# EAGLE design RJ45 Adapter (EAGLE 8.4.0)
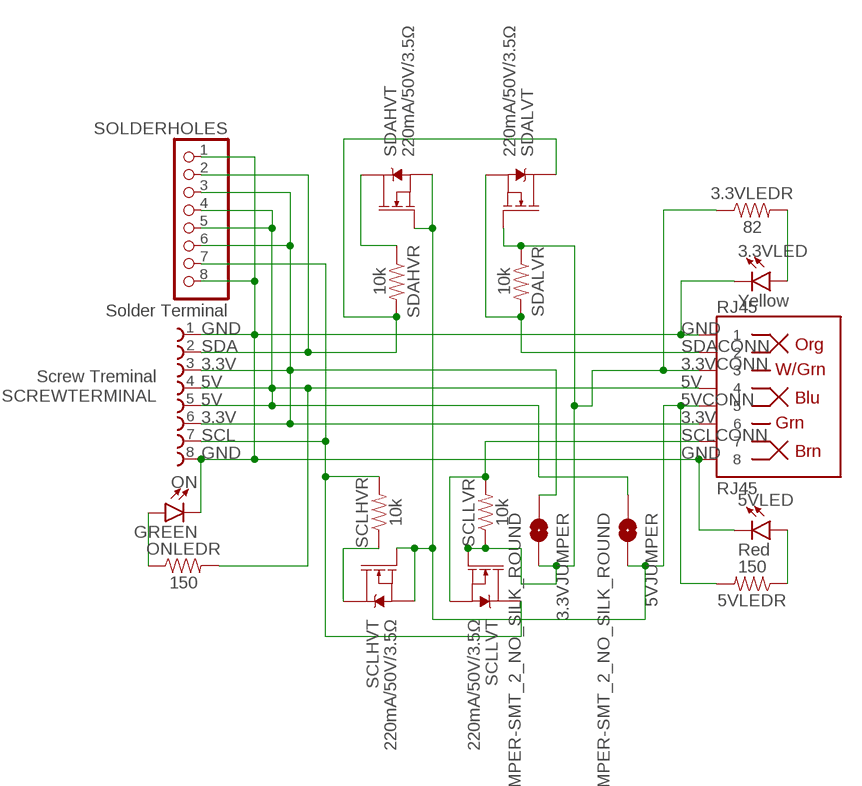
[diagram p0: schematic, sheet 1]

## Parts
3.3VJUMPER  JUMPER-SMT_2_NO_SILK_ROUND  [SMT-JUMPER_2_NO_SILK_ROUND]
3.3VLED  Yellow  LED-YELLOW0603-SMART  [LED-0603]
3.3VLEDR  82  82OHM-0603-1/10W-1%  [0603]
5VJUMPER  JUMPER-SMT_2_NO_SILK_ROUND  [SMT-JUMPER_2_NO_SILK_ROUND]
5VLED  Red  LED-RED0603-SMART  [LED-0603]
5VLEDR  150  150OHM-0603-1/10W-1%  [0603]
ON  GREEN  LED-GREEN0603  [LED-0603]
ONLEDR  150  150OHM-0603-1/10W-1%  [0603]
RJ45  RJ45  RJ45-8  [RJ45-8]
SCLHVR  10k  10KOHM-0603-1/10W-1%  [0603]
SCLHVT  220mA/50V/3.5Ω  MOSFET-NCH-BSS138  [SOT23-3]
SCLLVR  10k  10KOHM-0603-1/10W-1%  [0603]
SCLLVT  220mA/50V/3.5Ω  MOSFET-NCH-BSS138  [SOT23-3]
SCREWTERMINAL  Screw Treminal  691243300008  [691243300008]
SDAHVR  10k  10KOHM-0603-1/10W-1%  [0603]
SDAHVT  220mA/50V/3.5Ω  MOSFET-NCH-BSS138  [SOT23-3]
SDALVR  10k  10KOHM-0603-1/10W-1%  [0603]
SDALVT  220mA/50V/3.5Ω  MOSFET-NCH-BSS138  [SOT23-3]
SOLDERHOLES  Solder Terminal  PINHD-1X8-3.5MM  [1X08-3.5MM]

## Nets
3.3LEDR: 3.3VLED.A 3.3VLEDR.2
3.3V: 3.3VJUMPER.1 RJ45.6 SCREWTERMINAL.3 SCREWTERMINAL.6 SOLDERHOLES.3 SOLDERHOLES.6
3.3VCONN: 3.3VJUMPER.2 3.3VLEDR.1 RJ45.3 SCLLVR.1 SCLLVT.1(G) SDALVR.1 SDALVT.1(G)
5V: 5VJUMPER.1 ONLEDR.2 RJ45.4 SCREWTERMINAL.4 SCREWTERMINAL.5 SOLDERHOLES.4 SOLDERHOLES.5
5VCONN: 5VJUMPER.2 5VLEDR.2 RJ45.5 SCLHVT.1(G) SCLHVT.2(S) SDAHVT.1(G) SDAHVT.2(S)
5VLEDR: 5VLED.A 5VLEDR.1
GND: 3.3VLED.C 5VLED.C ON.C RJ45.1 RJ45.8 SCREWTERMINAL.1 SCREWTERMINAL.8 SOLDERHOLES.1 SOLDERHOLES.8
ONLEDR: ON.A ONLEDR.1
SCL: SCLHVR.2 SCLLVT.3(D) SCREWTERMINAL.7 SOLDERHOLES.7
SCLCONN: RJ45.7 SCLLVR.2 SCLLVT.2(S)
SCLHV: SCLHVR.1 SCLHVT.3(D)
SDA: SCREWTERMINAL.2 SDAHVR.2 SDALVT.3(D) SOLDERHOLES.2
SDACONN: RJ45.2 SDALVR.2 SDALVT.2(S)
SDAHV: SDAHVR.1 SDAHVT.3(D)

## Library data of the parts
3.3VJUMPER 5VJUMPER = SparkFun-Jumpers:JUMPER-SMT_2_NO: Normally open jumper This jumper has two pads in close proximity to each other. Apply solder to close the connection. Round pads are easier to solder for beginners, but are a lot larger. SparkFun Product that uses the round pads: SparkFun EL Sequencer <https://www.sparkfun.com/products/12781>
3.3VLED = SparkFun-LED:LED-YELLOW: Yellow SMD LED Used in manufacturing several products at SparkFun. Packages: 0603 - SMD 0603 package[Product Link] <http://www.kingbrightusa.com/product.asp?catalog_name=LED&product_id=APT1608SYCK> 0603 -SMART - SMART SMD 0603 package (more efficient/more expensive) [Product Link] <http://www.osram-os.com/osram_os/en/products/product-catalog/led-light-emitting-diodes/smartled-0603/ly-l29k/index.jsp> LilyPad - SMD1206 package[Product Datasheet] <https://www.sparkfun.com/datasheets/DevTools/LilyPad/Q150YUS4.pdf> SparkFun Products: Blynk Board <https://www.sparkfun.com/products/13794> IOIO-OTG <https://www.sparkfun.com/products/13613> XBee Explorer Serial <https://www.sparkfun.com/products/13225>; PROD_ID: DIO-11230
3.3VLEDR = SparkFun-Resistors:82OHM: 82Ω resistor A resistor is a passive two-terminal electrical component that implements electrical resistance as a circuit element. Resistors act to reduce current flow, and, at the same time, act to lower voltage levels within circuits. - Wikipedia; PROD_ID: RES-12311
5VLED = SparkFun-LED:LED-RED: Red SMD LED Used in manufacturing of most products at SparkFun Packages: 0603 - SMD 0603 package [Product Link] <http://docs.avagotech.com/docs/AV02-0551EN> 0603 SMART - SMD 0603 SMART package ( more efficient and expensive)[Product Link] <http://www.osram-os.com/Graphics/XPic2/00077099_0.pdf> 1206 - SMD1206 package [Product Link] <https://www.sparkfun.com/datasheets/DevTools/LilyPad/Q150OVS4.pdff> SparkFun Products: Pro Mini 328 -5V <https://www.sparkfun.com/products/821> RedBoard <https://www.sparkfun.com/products/12757> IOIO-OTG <https://www.sparkfun.com/products/13613>; PROD_ID: DIO-11154
5VLEDR ONLEDR = SparkFun-Resistors:150OHM: 150Ω resistor A resistor is a passive two-terminal electrical component that implements electrical resistance as a circuit element. Resistors act to reduce current flow, and, at the same time, act to lower voltage levels within circuits. - Wikipedia; PROD_ID: RES-11028
ON = SparkFun-LED:LED-GREEN: Green SMD LED Used in manufacturing of various products at SparkFun Packages: 0603 - SMD 0603 package [Product Link] <http://www.futureelectronics.com/en/technologies/semiconductors/optoelectronics/leds/Pages/9894312-LTST-C190GKT.aspx?CrossPart=HSMG-C190&IM=0> LilyPad 1206 - SMD1206 LilyPad package [Product Link] <http://www.futureelectronics.com/en/Technologies/Product.aspx?ProductID=IN150NGHARVATEKCORPORATION2049943&IM=0> 1206 - SMD1206 package [Product Link] <http://www.futureelectronics.com/en/technologies/semiconductors/optoelectronics/leds/Pages/8315665-LTST-C150KGKT.aspx?IM=0> 1206 Bottom Mount -SMD 1206 Bottom Mount [Product Link] <http://www.digikey.com/product-detail/en/lite-on-inc/LTST-C230KGKT/160-1456-1-ND/386854> SparkFun Products: Pro Mini 328 -5V <https://www.sparkfun.com/products/821> RedBoard <https://www.sparkfun.com/products/12757> MP3 Trigger <https://www.sparkfun.com/products/13720> Makey Makey <https://www.sparkfun.com/products/11076>; PROD_ID: DIO-00821
RJ45 = SparkFun-Connectors:RJ45-8: RJ45 Jack - 8 pin Simple RJ45, 8-pin connection. Commonly used for Cat5, Cat5e, and Cat6 Ethernet cables. Here is the connector we sell at SparkFun: RJ45 8-Pin Connector <https://www.sparkfun.com/products/643> (PRT-00643) Datasheet <https://cdn.sparkfun.com/datasheets/Prototyping/04908.pdf> It is used on this SparkFun product: SparkFun RJ45 Breakout <https://www.sparkfun.com/products/716> (BOB-00716) Note, you may also be interested in the "MAGJACK" version of this. It is basically a RJ45 connector, but also has some status LEDs built into the connector housing. You can check that out in this library at the device named "MAGJACK.dev" and see these products online: RJ45 Ethernet MagJack-Compatible <https://www.sparkfun.com/products/8534> (PRT-08534) SparkFun RJ45 MagJack Breakout <https://www.sparkfun.com/products/13021> (BOB-13021); PROD_ID: CONN-08506; SF_ID: PRT-00643
SCLHVR SCLLVR SDAHVR SDALVR = SparkFun-Resistors:10KOHM: 10kΩ resistor A resistor is a passive two-terminal electrical component that implements electrical resistance as a circuit element. Resistors act to reduce current flow, and, at the same time, act to lower voltage levels within circuits. - Wikipedia; PROD_ID: RES-00824
SCLHVT SCLLVT SDAHVT SDALVT = SparkFun-DiscreteSemi:MOSFET-NCH: N-channel MOSFETs Voltage controlled devices that allow control of high current outputs. SparkFun Products: SparkFun OpenScale <https://www.sparkfun.com/products/13261> SparkFun Digital Sandbox <https://www.sparkfun.com/products/12651> SparkFun Monster Moto Shield <https://www.sparkfun.com/products/10182> SparkFun MOSFET Power Controller <https://www.sparkfun.com/products/11214>; PROD_ID: TRANS-00830
SCREWTERMINAL = Wurth_Elektronik_Electromechanic_Terminal_Blocks_Connectors_rev17a:691243300008: SERIE 2433 - 3.81 MM - VERTICAL CABLE ENTRY WITH RISING CAGE CLAMP - WR-TBL =>ConTBL2 691243300008 Characteristics INSULATOR:PA6/66 FLAMABILITY RATING: UL94V0 COLOR: GREEN METAL HOUSING: COPPER ALLOY / Ni+Sn TERMINAL SCREW: STEEL / Zn WIRE GUARD: COPPER ALLOY / Ni+Sn OPERATING TEMPERATURE:-30°C UP TO +120°C COMPLIANCE: LEAD FREE AND ROHS ELECTRICAL UL VDE CURRENT RATING: 10A 10A WORKING VOLTAGE: 300VAC 130VAC WITHSTANDING VOLTAGE: 1,6KV 1,25KV CONTACT RESISTANCE: 20 mOhm max <http://katalog.we-online.de/media/images/v2/Family_TBL_3_81_2433_VERTICAL_CABLE_ENTRY_W_RISING_CLAMP_6912433000XX.jpg> Details see: http://katalog.we-online.de/en/em/TBL_3_81_2433_VERTICAL_CABLE_ENTRY_W_RISING_CLAMP_6912433000XX 2015 (C) Wurth Elektronik
SOLDERHOLES = adafruit:PINHD-1X8: PIN HEADER

## Board
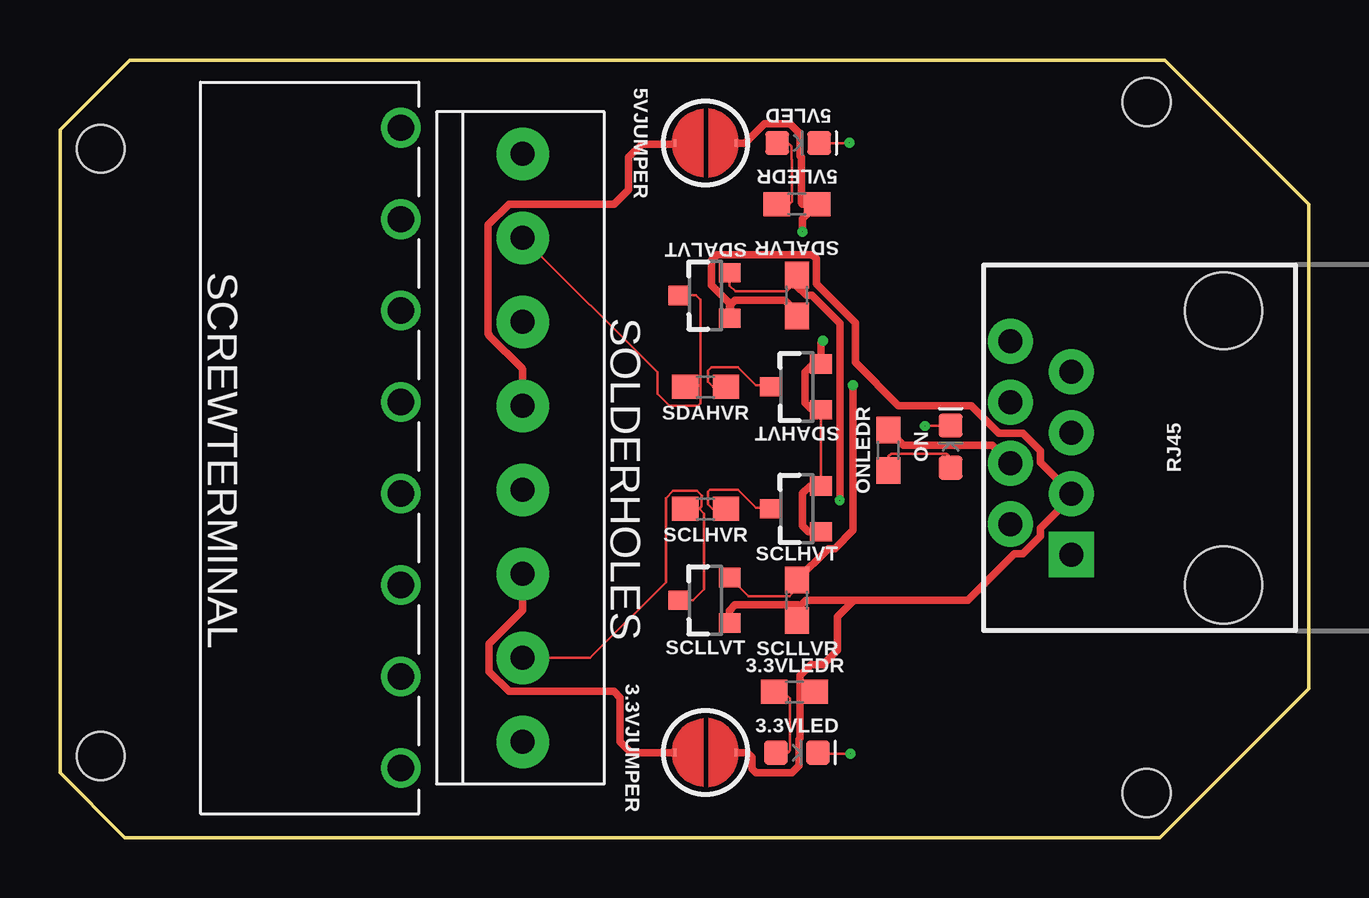
[diagram p1: board, top side]
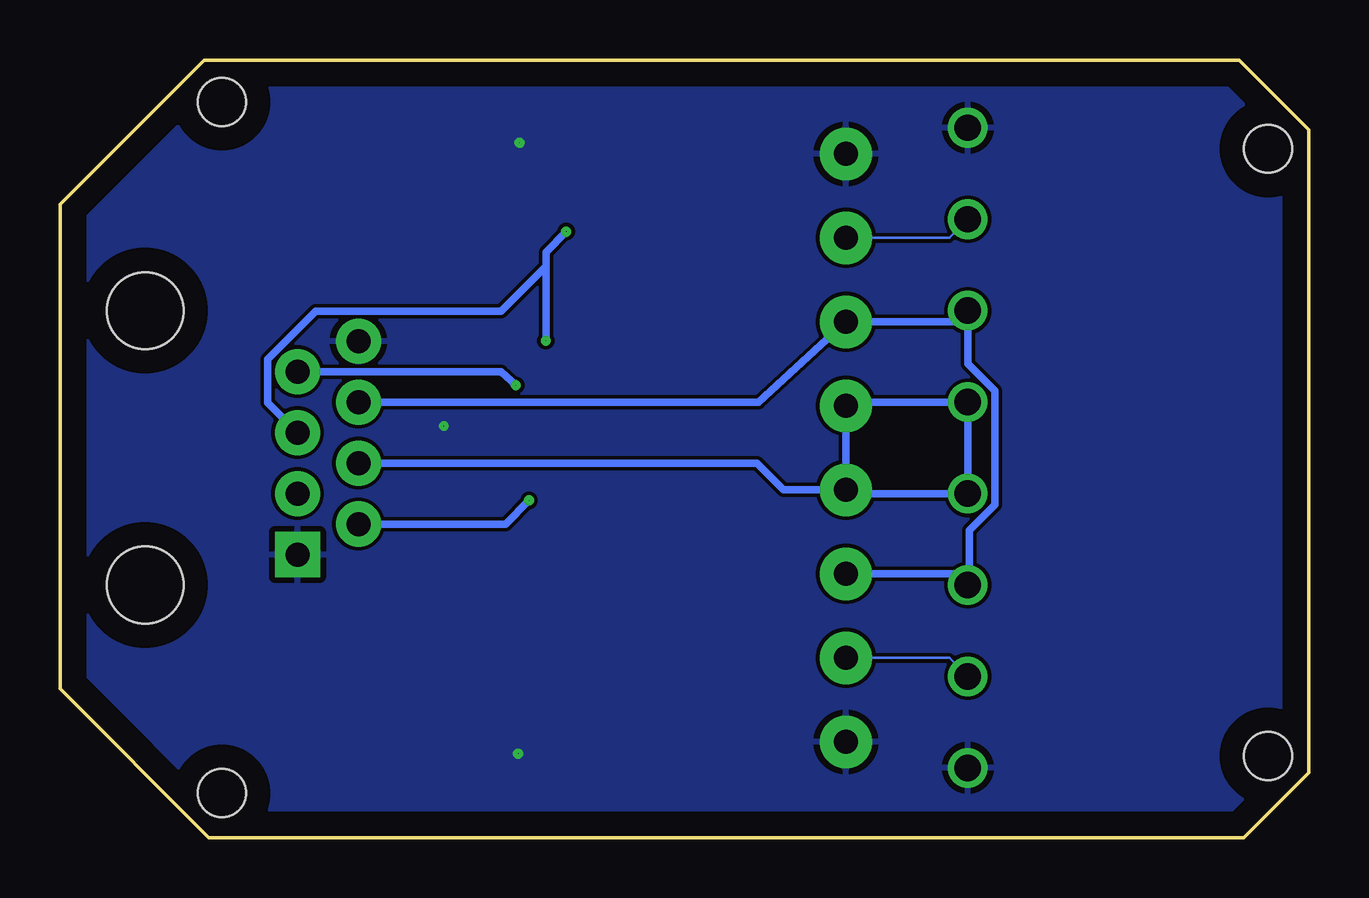
[diagram p2: board, bottom side, seen from below]

Size 52.05 x 32.4 mm. Coordinates in mm from the lower left corner, seen from the top.
Outline: 0,2.7 0,29.5 2.9,32.4 46.05,32.4 52.05,26.4 52.05,6.2 45.85,0 2.7,0 0,2.7
Copper layers (1*16): Top 0.035mm / dielectric 1.5mm / Bottom 0.035mm
Design rules "default": minimum track width 6mil, minimum drill 0.35mm, track to track 6mil, track to pad 6mil, pad to pad 6mil, via to via 6mil, smd to smd 6mil, copper to edge 40mil, drill to drill 6mil, minimum pad ring 10mil, minimum via ring 8mil, stop-mask expansion 4mil, vias tented up to drill 0mil, thermal gap 10mil
Holes 2 mm at 45.3,30.65 45.3,1.85 1.7,28.7 1.7,3.4

### Footprints (pad centres in the part's own frame; a part is rotated, then mirrored left to right if it is on the bottom)
SMT-JUMPER_2_NO_SILK_ROUND = smd 0.152 x 0.305: 1 -1.27,0; 2 1.27,0
LED-0603 = smd 1 x 1: A -0.877,0; C 0.877,0
0603 = smd 1.1 x 1: 1 -0.85,0; 2 0.85,0
RJ45-8 = drill 1 pad 1.88 square: 1 -4.445,6.35 | drill 1 pad 1.88: 2 -3.175,8.89; 3 -1.905,6.35; 4 -0.635,8.89; 5 0.635,6.35; 6 1.905,8.89; 7 3.175,6.35; 8 4.445,8.89 | hole 3.2: -5.715,0; 5.715,0
SOT23-3 = smd 0.8 x 0.9: 1 -0.95,-1; 2 0.95,-1; 3 0,1.1
691243300008 = drill 1.1: 1 -13.335,0; 2 -9.525,0; 3 -5.715,0; 4 -1.905,0; 5 1.905,0; 6 5.715,0; 7 9.525,0; 8 13.335,0
1X08-3.5MM = drill 1 pad 2.184: 1 -12.25,0; 2 -8.75,0; 3 -5.25,0; 4 -1.75,0; 5 1.75,0; 6 5.25,0; 7 8.75,0; 8 12.25,0

### Placement (x,y rotation side)
3.3VJUMPER  26.91,3.54 0 top
3.3VLED  30.72,3.54 0 top
3.3VLEDR  30.62,6.08 180 top
5VJUMPER  26.91,28.94 0 top
5VLED  30.77,28.94 0 top
5VLEDR  30.72,26.4 0 top
ON  37.12,16.29 90 top
ONLEDR  34.53,16.14 90 top
RJ45  48.5,16.24 90 top
SCLHVR  26.91,13.7 180 top
SCLHVT  30.72,13.7 90 top
SCLLVR  30.72,9.89 90 top
SCLLVT  26.91,9.89 90 top
SCREWTERMINAL  14.21,16.24 270 top
SDAHVR  26.91,18.78 180 top
SDAHVT  30.72,18.78 90 top
SDALVR  30.72,22.59 90 top
SDALVT  26.91,22.59 90 top
SOLDERHOLES  19.29,16.24 270 top

### Tracks (layer width: path | path; a pad name or v marks a point on that pad's centre or on a via)
3.3LEDR
  Top 0.102: 3.3VLED.A 30.34,3.54 30.44,3.64 30.44,5.81 30.17,6.08 3.3VLEDR.2
3.3V
  Top 0.305: SOLDERHOLES.6 19.29,9.47 17.89,8.07 17.89,6.91 18.71,6.09 23.09,6.09 23.35,5.83 23.35,4 23.81,3.54 3.3VJUMPER.1
  Bottom 0.305: SOLDERHOLES.6 14.68,10.99 SCREWTERMINAL.6 14.15,10.59 14.15,12.8 13.75,13.21 13.74,13.21 13.08,13.87 13.08,18.61 14.21,19.74 SCREWTERMINAL.3 14.68,21.49 SOLDERHOLES.3 22.93,18.15 39.35,18.15 RJ45.6
3.3VCONN
  Top 0.102: 30.72,21.9 SDALVR.1 | 27.95,22.2 28.15,22.4
  Top 0.305: 3.3VLEDR.1 31.34,5.95 30.85,5.95 | 30.85,5.95 30.85,4.14 30.79,4.08 30.79,3 30.8,3 30.5,2.7 29.02,2.7 28.85,2.87 28.85,3.34 28.65,3.54 3.3VJUMPER.2 | 28.3,22.39 28.14,22.39 27.95,22.2 27.95,21.68 SDALVT.1 27.91,22.26 27.16,23.01 27.16,24.07 27.38,24.3 31.35,24.3 31.52,24.12 31.52,23.07 33.15,21.45 33.15,19.8 34.95,18 37.99,18 39.15,16.85 40.13,16.85 40.85,16.12 40.85,15.63 RJ45.3 42.15,14.19 40.85,12.89 40.85,12.55 40.13,11.82 39.78,11.82 37.84,9.88 33.09,9.88 | 28.15,22.4 30.22,22.4 30.72,21.9 | 30.83,9.62 30.72,9.52 | 30.83,9.62 31.09,9.88 33.09,9.88 | 30.85,5.95 30.85,6.75 31.3,7.2 31.8,7.2 32.4,7.8 32.4,9.2 33.09,9.88 | SCLLVT.1 27.91,9.46 28.14,9.69 30.76,9.69 30.83,9.62 | SCLLVR.1 30.83,9.14 30.83,9.62
5V
  Top 0.305: SOLDERHOLES.4 19.29,19.51 19.25,19.55 17.89,20.91 17.89,20.96 17.85,21 17.85,25.53 18.71,26.39 23.09,26.39 23.7,27 23.7,28.35 24.25,28.9 25.6,28.9 5VJUMPER.1 | ONLEDR.2 35.16,16.36 38.86,16.36 RJ45.4
  Bottom 0.305: SOLDERHOLES.5 19.13,14.34 SCREWTERMINAL.5 SCREWTERMINAL.4 19.13,18.14 SOLDERHOLES.4 SOLDERHOLES.5 | SOLDERHOLES.5 21.89,14.49 23,15.6 RJ45.4
5VCONN  (via drill 0.01)
  Top 0.102: 31.7,14.65 SCLHVT.2 | 31.4,14.65 31.7,14.65 | 31.3,17.88 31.67,17.88 SDAHVT.1 31.72,14.67 31.7,14.65
  Top 0.305: v30.95,25.25 30.95,25.78 5VLEDR.2 30.95,26.4 30.9,26.45 30.9,28.34 30.84,28.4 30.84,29.33 30.43,29.75 29.35,29.75 28.55,28.94 5VJUMPER.2 | v31.8,20.7 31.72,20.62 SDAHVT.2 31.38,19.73 31.05,19.4 31.05,18.12 31.3,17.88 | SCLHVT.1 31.2,12.75 30.95,13 30.95,14.35 31.25,14.65 31.4,14.65
  Bottom 0.305: v30.95,25.25 31.8,24.4 31.8,23.8 | v31.8,20.7 31.8,23.8 | 31.8,23.8 33.67,21.93 41.4,21.93 43.4,19.93 43.4,18.12 RJ45.5
5VLEDR
  Top 0.102: 5VLED.A 30.35,28.94 30.49,28.8 30.49,28.25 30.5,28.24 30.5,26.5 30.4,26.4 5VLEDR.1
GND  (via drill 0.01)
  Top 0.102: 5VLED.C v32.89,28.94 v32.9,28.95 | ON.C 36.07,17.17 v36.05,17.15 | 3.3VLED.C 31.64,3.5 v32.95,3.5
  other vias: 14.21,29.57
  pour Bottom: 2.95,32.25 0.15,29.45 0.15,2.75 2.75,0.15 8.35,0.15 45.8,0.15 51.9,6.25 51.9,26.35 46,32.25 44.05,32.25
ONLEDR
  Top 0.102: ONLEDR.1 34.53,15.88 34.65,16 36.95,16 37.02,15.93 37.02,15.51 ON.A
SCL
  Top 0.102: SCLHVR.2 26.65,13.7 | 26.65,13.7 26.85,13.5 26.85,10.35 26.39,9.89 SCLLVT.3 | 26.65,13.7 26.75,13.8 26.75,14.25 26.55,14.45 25.55,14.45 25.25,14.15 25.25,10.65 22.09,7.49 SOLDERHOLES.7
  Bottom 0.102: SOLDERHOLES.7 14.98,7.49 SCREWTERMINAL.7
SCLCONN  (via drill 0.01)
  Top 0.102: SCLLVR.2 30.72,10.37 30.4,10.05 28.7,10.05 SCLLVT.2
  Top 0.305: SCLLVR.2 32.02,12.04 32.3,12.04 33.05,12.8 v33.05,18.85
  Bottom 0.305: v33.05,18.85 33.66,19.41 RJ45.7
SCLHV
  Top 0.102: SCLHVR.1 27.2,13.7 27,13.9 27,14.1 27,14.4 27.1,14.5 28.25,14.5 29,13.75 29.57,13.75 SCLHVT.3
SDA
  Top 0.102: 26.7,18.9 26.7,22.4 26.51,22.59 SDALVT.3 | SDAHVR.2 26.58,18.78 26.7,18.9 | 26.7,18.9 26.7,18.1 26.6,18 25.4,18 24.9,18.5 24.9,19.38 SOLDERHOLES.2
  Bottom 0.102: SOLDERHOLES.2 14.98,24.99 SCREWTERMINAL.2
SDACONN  (via drill 0.01)
  Top 0.102: SDALVT.2 27.91,23 28.15,22.76 30.3,22.76 30.72,23.18 SDALVR.2
  Top 0.305: v32.5,14.05 32.5,21.44 31.35,22.59 31.1,22.59 30.72,22.98 SDALVR.2
  Bottom 0.305: v32.5,14.05 33.48,13.06 RJ45.2
SDAHV
  Top 0.102: 29.6,18.78 29.55,18.78 | 29.6,18.78 SDAHVT.3 | 27.32,18.78 SDAHVR.1 27.22,18.78 27,19 27,19.45 27.15,19.6 28.25,19.6 29,18.85 29.53,18.85 29.6,18.78

### Text on the board
silktop: Solder for 5V Devices | GND | GND | SDA | SDA | 3.3V | 3.3V | 5V | 5V | 5V | 5V | 3.3V | 3.3V | SCL | SCL | GND | GND | Created By / Lynton Brown / 12/12/2017 | Solder for 3.3V Devices
silkbottom: I2C Device / Adapter